# EAGLE design flute (EAGLE 6.1)
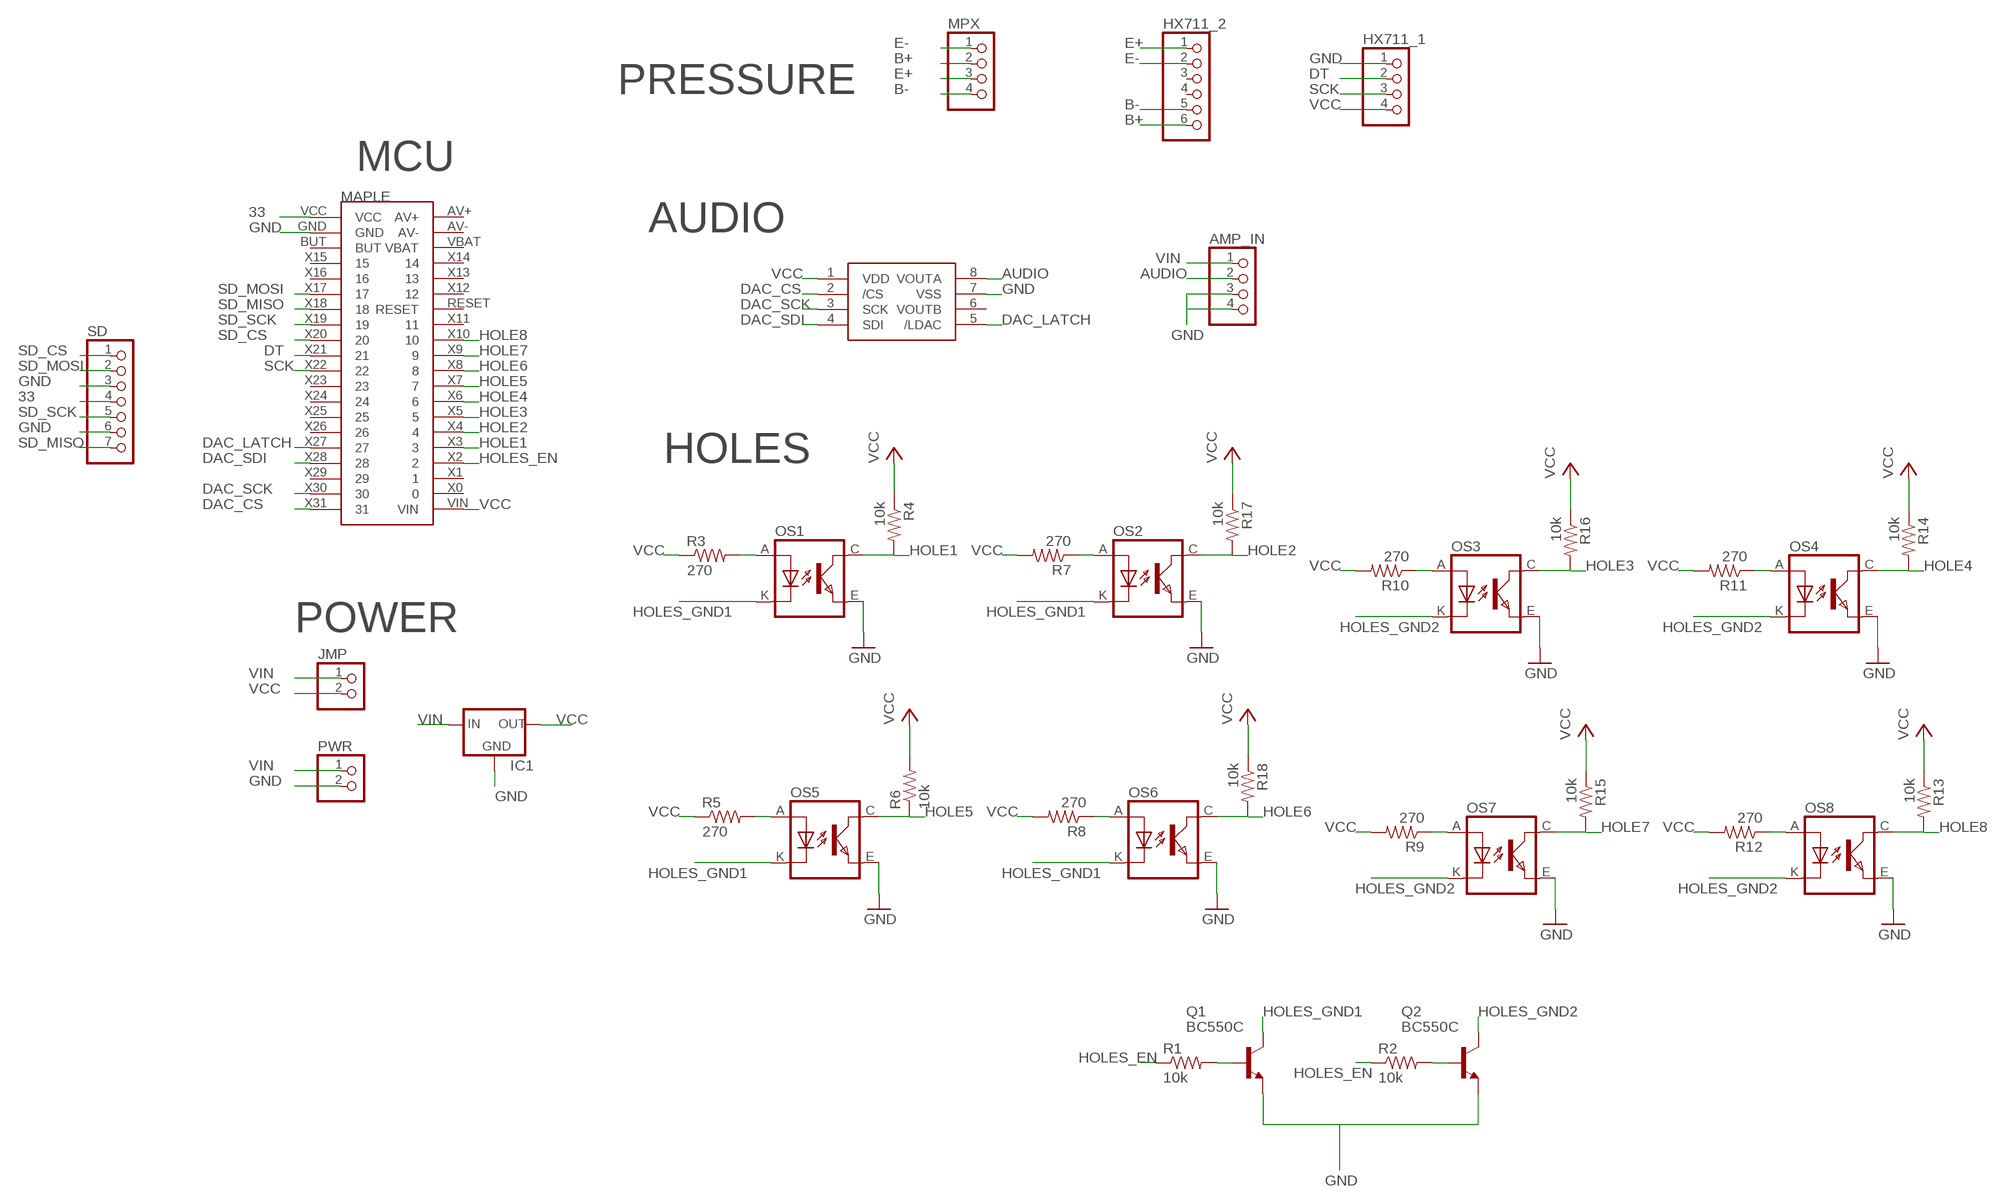
[diagram p0: schematic, sheet 1]

## Parts
AMP_IN  CONNEC_1X04  [CONNEC_1X04]
HX711_1  CONNEC_1X04  [CONNEC_1X04]
HX711_2  CONNEC_1X06  [CONNEC_1X06]
IC1  V_REG_78XX-TO-220  [TO-220-ALT]
JMP  CONNEC_1X02BASIC  [CONNEC_1X02]
MAPLE  MAPLE_MINI  [CONNEC_2X20]
MPX  CONNEC_1X04  [CONNEC_1X04]
OS1  TCRT5000  [TCRT5000]
OS2  TCRT5000  [TCRT5000]
OS3  TCRT5000  [TCRT5000]
OS4  TCRT5000  [TCRT5000]
OS5  TCRT5000  [TCRT5000]
OS6  TCRT5000  [TCRT5000]
OS7  TCRT5000  [TCRT5000]
OS8  TCRT5000  [TCRT5000]
PWR  CONNEC_1X02BASIC  [CONNEC_1X02]
Q1  BC550C  [TO92-EBC]
Q2  BC550C  [TO92-EBC]
R1  10k  RESISTOR0805-RES  [0805]
R2  10k  RESISTOR0805-RES  [0805]
R3  270  RESISTOR0805-RES  [0805]
R4  10k  RESISTOR0805-RES  [0805]
R5  270  RESISTOR0805-RES  [0805]
R6  10k  RESISTOR0805-RES  [0805]
R7  270  RESISTOR0805-RES  [0805]
R8  270  RESISTOR0805-RES  [0805]
R9  270  RESISTOR0805-RES  [0805]
R10  270  RESISTOR0805-RES  [0805]
R11  270  RESISTOR0805-RES  [0805]
R12  270  RESISTOR0805-RES  [0805]
R13  10k  RESISTOR0805-RES  [0805]
R14  10k  RESISTOR0805-RES  [0805]
R15  10k  RESISTOR0805-RES  [0805]
R16  10k  RESISTOR0805-RES  [0805]
R17  10k  RESISTOR0805-RES  [0805]
R18  10k  RESISTOR0805-RES  [0805]
SD  CONNEC_1X07  [CONNEC_1X07]
U$17  MCP4822  [SO08]

## Nets
33: MAPLE.VCC SD.4
AUDIO: AMP_IN.2 U$17.8(VOUTA)
B+: HX711_2.6 MPX.2
B-: HX711_2.5 MPX.4
DAC_CS: MAPLE.X31 U$17.2(/CS)
DAC_LATCH: MAPLE.X27 U$17.5(/LDAC)
DAC_SCK: MAPLE.X30 U$17.3(SCK)
DAC_SDI: MAPLE.X28 U$17.4(SDI)
DT: HX711_1.2 MAPLE.X21
E+: HX711_2.1 MPX.3
E-: HX711_2.2 MPX.1
GND [alim]: AMP_IN.3 AMP_IN.4 HX711_1.1 IC1.GND MAPLE.GND OS1.E(EMITTER) OS2.E(EMITTER) OS3.E(EMITTER) OS4.E(EMITTER) OS5.E(EMITTER) OS6.E(EMITTER) OS7.E(EMITTER) OS8.E(EMITTER) PWR.2 Q1.E Q2.E SD.3 SD.6 U$17.7(VSS)
HOLE1: MAPLE.X3 OS1.C(COLLECTOR) R4.2
HOLE2: MAPLE.X4 OS2.C(COLLECTOR) R17.2
HOLE3: MAPLE.X5 OS3.C(COLLECTOR) R16.2
HOLE4: MAPLE.X6 OS4.C(COLLECTOR) R14.2
HOLE5: MAPLE.X7 OS5.C(COLLECTOR) R6.1
HOLE6: MAPLE.X8 OS6.C(COLLECTOR) R18.2
HOLE7: MAPLE.X9 OS7.C(COLLECTOR) R15.2
HOLE8: MAPLE.X10 OS8.C(COLLECTOR) R13.2
HOLES_EN: MAPLE.X2 R1.1 R2.1
HOLES_GND1: OS1.K(CATHODE) OS2.K(CATHODE) OS5.K(CATHODE) OS6.K(CATHODE) Q1.C
HOLES_GND2: OS3.K(CATHODE) OS4.K(CATHODE) OS7.K(CATHODE) OS8.K(CATHODE) Q2.C
N$3: Q1.B R1.2
N$4: Q2.B R2.2
N$5: OS1.A(ANODE) R3.2
N$7: OS2.A(ANODE) R7.1
N$9: OS3.A(ANODE) R10.1
N$11: OS4.A(ANODE) R11.1
N$13: OS5.A(ANODE) R5.2
N$15: OS6.A(ANODE) R8.1
N$17: OS7.A(ANODE) R9.1
N$19: OS8.A(ANODE) R12.1
SCK: HX711_1.3 MAPLE.X22
SD_CS: MAPLE.X20 SD.1
SD_MISO: MAPLE.X18 SD.7
SD_MOSI: MAPLE.X17 SD.2
SD_SCK: MAPLE.X19 SD.5
VCC: HX711_1.4 IC1.OUT JMP.2 MAPLE.VIN R3.1 R4.1 R5.1 R6.2 R7.2 R8.2 R9.2 R10.2 R11.2 R12.2 R13.1 R14.1 R15.1 R16.1 R17.1 R18.1 U$17.1(VDD)
VIN [alim]: AMP_IN.1 IC1.IN JMP.1 PWR.1
Unconnected: HX711_2.3 HX711_2.4 MAPLE.AV+ MAPLE.AV- MAPLE.BUT MAPLE.RESET MAPLE.VBAT MAPLE.X0 MAPLE.X1 MAPLE.X11 MAPLE.X12 MAPLE.X13 MAPLE.X14 MAPLE.X15 MAPLE.X16 MAPLE.X23 MAPLE.X24 MAPLE.X25 MAPLE.X26 MAPLE.X29 U$17.6(VOUTB)

## Notes on the sheet
- PRESSURE
- MCU
- AUDIO
- HOLES
- POWER

## Library data of the parts
AMP_IN HX711_1 MPX = rhoban:CONNEC_1X04
HX711_2 = rhoban:CONNEC_1X06
IC1 = SparkFun-PowerIC:V_REG_78XX: Voltage Regulator Standard 7805 5V regulator. IGO (Input Ground Output). Spark Fun Electronics SKU : COM-00107
JMP PWR = rhoban:CONNEC_1X02
MAPLE = rhoban:MAPLE_MINI
OS1-OS8 = tcrt5000:TCRT5000
Q1 Q2 = transistor-npn:BC550*: NPN Transistor
R1-R18 = SparkFun-Passives:RESISTOR: Resistor Basic schematic elements and footprints for 0603, 1206, and PTH resistors.
SD = rhoban:CONNEC_1X07
U$17 = rhoban:MCP4822

## Net classes
0 default: width 0.305 mm
1 alim: width 0.762 mm, clearance 0.076 mm

## Board
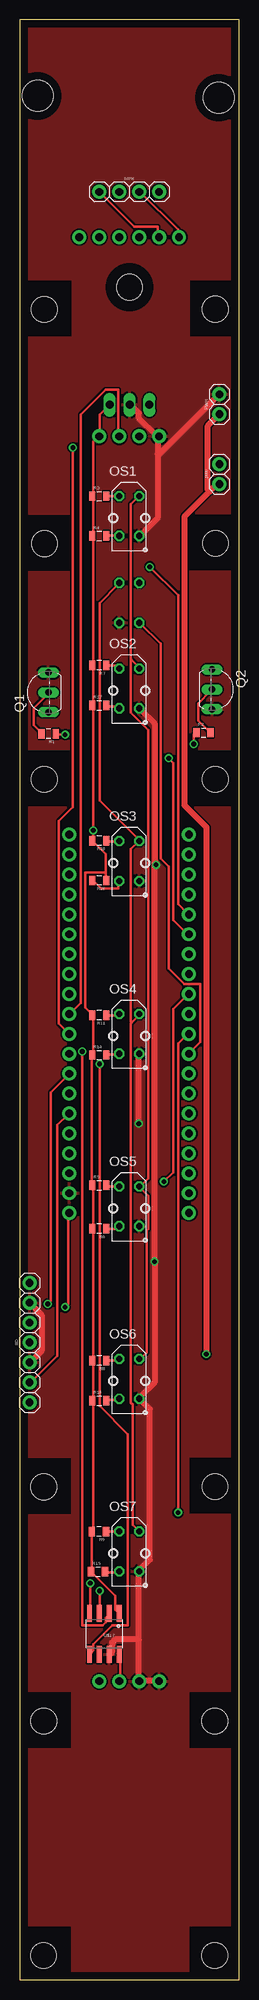
[diagram p1: board, top side]
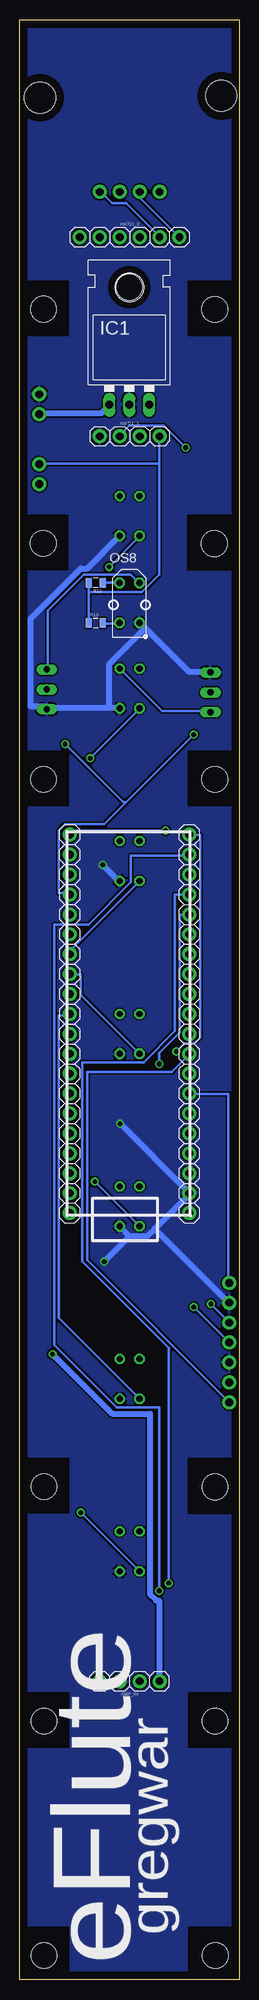
[diagram p2: board, bottom side, seen from below]

Size 28 x 250 mm. Coordinates in mm from the lower left corner, seen from the top.
Outline: 0,0 28,0 28,250 0,250 0,0
Copper layers (1*16): Top 0.035mm / dielectric 1.5mm / Bottom 0.035mm
Design rules: minimum track width 10mil, minimum drill 24mil, track to track 8mil, track to pad 8mil, pad to pad 8mil, via to via 8mil, smd to smd 8mil, copper to edge 40mil, drill to drill 8mil, minimum pad ring 10mil, minimum via ring 8mil, stop-mask expansion 4mil, vias tented up to drill 0mil, thermal gap 10mil
Holes 4 mm at 2.29,240.28 25.4,240.03
tRestrict: area -0.1,-0.3 to 6.5,6.8; area 21.7,-0.3 to 28.3,6.8; area -0.1,29.6 to 6.5,36.7; area 21.7,29.6 to 28.3,36.7; area -0.1,59.5 to 6.5,66.5; area 21.7,59.5 to 28.4,66.6; area -0.1,149.7 to 6.6,156.8; area 21.8,149.7 to 28.4,156.8; area 0,179.8 to 6.6,186.8; area 21.8,179.8 to 28.5,186.9; area -0.1,209.6 to 6.6,216.7; area 21.8,209.6 to 28.4,216.7
bRestrict: area -0.1,-0.3 to 6.5,6.8; area 21.7,-0.3 to 28.3,6.8; area -0.1,29.6 to 6.5,36.7; area 21.7,29.6 to 28.3,36.7; area -0.1,59.5 to 6.5,66.5; area 21.7,59.5 to 28.4,66.6; area -0.1,149.7 to 6.6,156.8; area 21.7,149.7 to 28.4,156.8; area 0,179.7 to 6.6,186.8; area 21.8,179.8 to 28.4,186.9; area -0.1,209.6 to 6.6,216.7; area 21.7,209.6 to 28.4,216.7

### Footprints (pad centres in the part's own frame; a part is rotated, then mirrored left to right if it is on the bottom)
CONNEC_1X04 = drill 1 pad 1.778: 1 -1.27,1.27; 2 1.27,1.27; 3 3.81,1.27; 4 6.35,1.27
CONNEC_1X06 = drill 1 pad 1.778: 1 -1.27,1.27; 2 1.27,1.27; 3 3.81,1.27; 4 6.35,1.27; 5 8.89,1.27; 6 11.43,1.27
TO-220-ALT = drill 1.016 long: GND 0,-3.81; IN -2.54,-3.81; OUT 2.54,-3.81 | hole 3.302: 0,11.176
CONNEC_1X02 = drill 1 pad 1.778: 1 -1.27,1.27; 2 1.27,1.27
CONNEC_2X20 = drill 1 pad 1.778: AV+ 0,0; AV- 2.54,0; BUT 5.08,-15.24; GND 2.54,-15.24; RESET 15.24,0; VBAT 5.08,0; VCC 0,-15.24; VIN 48.26,0; X0 45.72,0; X1 43.18,0; X2 40.64,0; X3 38.1,0; X4 35.56,0; X5 33.02,0; X6 30.48,0; X7 27.94,0; X8 25.4,0; X9 22.86,0; X10 20.32,0; X11 17.78,0; X12 12.7,0; X13 10.16,0; X14 7.62,0; X15 7.62,-15.24; X16 10.16,-15.24; X17 12.7,-15.24; X18 15.24,-15.24; X19 17.78,-15.24; X20 20.32,-15.24; X21 22.86,-15.24; X22 25.4,-15.24; X23 27.94,-15.24; X24 30.48,-15.24; X25 33.02,-15.24; X26 35.56,-15.24; X27 38.1,-15.24; X28 40.64,-15.24; X29 43.18,-15.24; X30 45.72,-15.24; X31 48.26,-15.24
TCRT5000 = drill 0.8 octagon: A -2.54,-1.27; C 2.54,-1.27; E 2.54,1.27; K -2.54,1.27
TO92-EBC = drill 0.813 long: B 0,-1.27; C -2.54,-1.27; E 2.54,-1.27
0805 = smd 0.8 x 1.2: 1 -0.9,0; 2 0.9,0
CONNEC_1X07 = drill 1 pad 1.778: 1 -1.27,1.27; 2 1.27,1.27; 3 3.81,1.27; 4 6.35,1.27; 5 8.89,1.27; 6 11.43,1.27; 7 13.97,1.27
STAND-OFF = hole 3.302: 0,0
SO08 = smd 0.61 x 2.21: 1 -1.905,-2.616; 2 -0.635,-2.616; 3 0.635,-2.616; 4 1.905,-2.616; 5 1.905,2.616; 6 0.635,2.616; 7 -0.635,2.616; 8 -1.905,2.616

### Placement (x,y rotation side)
AMP_IN  11.43,39.37 180 bottom
HX711_1  16.51,195.58 0 bottom
HX711_2  19.05,220.98 0 bottom
IC1  14.01,204.69 0 bottom
JMP  26.75,192.05 90 top
MAPLE  21.59,97.79 90 bottom
MPX  11.43,226.76 0 top
OS1  13.97,186.69 270 top
OS2  13.97,164.69 270 top
OS3  13.97,142.69 270 top
OS4  13.97,120.65 270 top
OS5  13.97,98.65 270 top
OS6  13.97,76.65 270 top
OS7  13.97,54.65 270 top
OS8  13.99,175.62 270 bottom
PWR  26.75,200.94 90 top
Q1  2.41,164.2 90 top
Q2  25.81,164.58 270 top
R1  3.7,158.92 180 top
R2  23.45,159.07 0 top
R3  10.16,189.23 0 top
R4  10.16,184.15 0 top
R5  10.16,101.36 0 top
R6  10.16,95.78 180 top
R7  10.16,167.64 180 top
R8  10.16,78.96 180 top
R9  10.11,57.17 180 top
R10  10.16,145.28 180 top
R11  10.16,123.03 180 top
R12  18.3,178.14 180 bottom
R13  18.3,173.06 0 bottom
R14  10.16,117.95 0 top
R15  9.99,52.08 0 top
R16  10.16,140.2 180 top
R17  10.16,162.56 0 top
R18  10.16,73.88 0 top
SD  2.54,74.93 90 top
U$1  [STAND-OFF]  3.06,3.1 0 top
U$2  [STAND-OFF]  24.87,3.12 0 top
U$3  [STAND-OFF]  3.07,33 0 top
U$4  [STAND-OFF]  24.88,33.02 0 top
U$5  [STAND-OFF]  3.08,62.88 0 top
U$6  [STAND-OFF]  24.89,62.9 0 top
U$7  [STAND-OFF]  3.13,153.11 0 top
U$8  [STAND-OFF]  24.94,153.13 0 top
U$9  [STAND-OFF]  3.18,183.18 0 top
U$10  [STAND-OFF]  24.99,183.19 0 top
U$11  [STAND-OFF]  3.13,213.05 0 top
U$12  [STAND-OFF]  24.94,213.07 0 top
U$17  10.8,44.13 180 top

### Tracks (layer width: path | path; a pad name or v marks a point on that pad's centre or on a via)
33  (via drill 0.61)
  Top 0.305: v5.8,85.8 6.2,86.2 6.2,97.6 MAPLE.VCC
  Bottom 0.305: v5.8,85.8 1.4,81.4 SD.4
AUDIO
  Top 0.305: U$17.8 12.8,41.4 12.8,38.2 AMP_IN.2
B+
  Bottom 0.305: HX711_2.6 7.8,222.4 12.6,227.2 12.6,228 MPX.2
B-
  Bottom 0.305: HX711_2.5 10.2,222.4 14.4,226.6 16.2,226.6 17.6,228 MPX.4
DAC_CS  (via drill 0.61)
  Top 0.305: v8,118.4 8,45.2 10.6,45.2 11,45.6 11,46.2 11.4,46.6 U$17.2
  Bottom 0.305: v8,118.4 7,119.4 5.8,119.4 5,120.2 5,146 6.2,146 MAPLE.X31
DAC_LATCH  (via drill 0.61)
  Top 0.305: v10.2,116.8 10.2,73.2 13.8,69.6 13.8,45.2 11.8,45.2 9.4,42.8 9.4,42 9,41.6 U$17.5
  Bottom 0.305: v10.2,116.8 10.2,118.2 7.6,120.8 7.6,135.8 6.4,135.8 MAPLE.X27
DAC_SCK  (via drill 0.61)
  Top 0.305: v10.2,49.6 10.2,46.8 U$17.3
  Bottom 0.305: v10.2,49.6 10.2,73 15.6,73 23.6,81 23.6,134.6 19.2,134.6 13.8,140 13.8,143.4 6.4,143.4 MAPLE.X30
DAC_SDI  (via drill 0.61)
  Top 0.305: v9,50.6 9,46.8 U$17.4
  Bottom 0.305: v9,50.6 9,80.6 20,91.6 20,117 12.2,117 8.2,121 8.2,138.4 6.4,138.4 MAPLE.X28
DT  (via drill 0.61)
  Top 0.305: MAPLE.X21 5,122 5,147.8 6.8,149.6 v6.8,195.4
  Bottom 0.305: v6.8,195.4 9.6,198.2 14,198.2 15.2,197 HX711_1.2
E+
  Top 0.305: MPX.3 15.4,228 20.2,223.2 20.2,222.4 HX711_2.1
E-
  Top 0.305: MPX.1 10.2,228 14.6,223.6 17.6,223.6 17.6,222.4 HX711_2.2
GND  (via drill 0.61)
  Top 0.762: 17.6,194.6 17.6,196.8 HX711_1.1 17.4,197 15.2,199.2 15.2,199.8 14.2,200.8 IC1.GND | 17.6,194.6 17.6,186.4 15.4,184.2 OS1.E | PWR.2 25.4,202.2 17.8,194.6 17.6,194.6 | OS2.E 15.4,162 17.2,160.2 17.2,142.4 v17.4,142.2 17.2,142 v17.2,91.6 17.2,76.2 15.4,74.4 OS6.E 15.4,74 16.6,72.8 16.6,53.6 15.4,52.4 OS7.E 15.2,52 15.2,43.4 | 15.2,43.4 12.2,43.4 11.8,43 11.8,41.8 11.6,41.6 U$17.7 | 15.2,43.4 15.2,38.2 AMP_IN.3 15.6,38.2 17.6,38.2 AMP_IN.4 | SD.3 1.4,78.8 2.8,80.2 2.8,84.8 1.4,86.2 SD.6 | v15.2,109.2 15.2,118 OS4.E
  Bottom 0.762: 12,172.4 6.4,166.8 3.8,166.8 Q1.E | 12,172.4 12.6,173 OS8.E | v17.4,142.2 15.4,140.2 OS3.E | 16.6,162.2 15.4,162.2 OS2.E | 16.6,162.2 24.4,162.2 Q2.E 24.6,162.4 26.6,162.4 26.6,173.6 20.2,180 19.4,180 15.4,184 OS1.E | 12,172.4 16.6,167.8 16.6,162.2 | 14,94.8 15.2,96 OS5.E | 14,94.8 11.8,94.8 10.8,95.8 | 10.8,95.8 6.4,100.2 MAPLE.GND 6.6,100.6 v15.2,109.2 | 10.8,95.8 1.4,86.4 SD.6 | 14,94.8 v17.2,91.6
  pour Top: -58.47,259.18 84.39,259.18 84.39,-14.37 -67.29,-14.37 -67.29,176.84
  pour Bottom: -9.93,265.81 43.58,265.81 43.58,-8.29 -30.34,-8.29 -30.34,233.21
HOLE1  (via drill 0.61)
  Top 0.305: R4.2 11.2,184.2 12.6,184.2 OS1.C | v16.6,180.2 20.2,176.6 20.2,137.2 21.4,136 MAPLE.X3
  Bottom 0.305: v16.6,180.2 12.8,184 OS1.C
HOLE2  (via drill 0.61)
  Top 0.305: R17.2 11.2,162.4 12.6,162.4 12.6,162.2 OS2.C | v19,155.8 19.6,155.2 19.6,135.2 21.4,133.4 MAPLE.X4
  Bottom 0.305: v19,155.8 12.8,162 OS2.C
HOLE3
  Top 0.305: R16.2 9.4,140.2 10.4,139.2 12.6,139.2 12.6,140 OS3.C
  Bottom 0.305: OS3.C 12.8,140 21.4,131.4 21.4,131 MAPLE.X5
HOLE4
  Top 0.305: R14.2 11.2,118 12.6,118 OS4.C
  Bottom 0.305: OS4.C 12.8,118.2 20.2,125.6 20.2,128.2 21.4,128.2 MAPLE.X6
HOLE5  (via drill 0.61)
  Top 0.305: R6.1 11.2,95.8 12.6,95.8 12.6,96 OS5.C | v18.4,101.8 19.6,103 19.6,123.8 21.4,125.6 MAPLE.X7
  Bottom 0.305: v18.4,101.8 12.8,96.2 OS5.C
HOLE6
  Top 0.305: R18.2 11.2,74 12.6,74 OS6.C
  Bottom 0.305: OS6.C 12.8,74.2 23,84.4 23,123 21.6,123 MAPLE.X8
HOLE7  (via drill 0.61)
  Top 0.305: R15.2 11,52 12.6,52 OS7.C | v20.2,59.6 20.2,119.4 21.4,120.6 MAPLE.X9
  Bottom 0.305: v20.2,59.6 12.8,52.2 OS7.C
HOLE8
  Top 0.305: OS8.C 15.4,173 18,170.4 18,143 19,142 19,129 21,127 23,127 23,119.6 21.6,118.2 MAPLE.X10
  Bottom 0.305: R13.2 17.2,173 15.4,173 OS8.C
HOLES_EN  (via drill 0.61)
  Top 0.305: v5.8,158.8 4.8,158.8 R1.1 | v22.2,157.6 22.2,158.8 22.4,159 R2.1
  Bottom 0.305: 14.5,150.1 17.2,147.4 22.2,147.4 23,146.6 23,138.6 21.6,138.6 MAPLE.X2 | 14.5,150.1 v5.8,158.8 | v22.2,157.6 14.8,150.2 14.6,150.2 14.5,150.1
HOLES_GND1
  Top 0.305: OS6.K 15.4,79.2 16.2,80 16.2,95.6 16.4,95.8 16.4,100 15.4,101 OS5.K 15.4,101.2 16.4,102.2 16.4,159.4 14.2,161.6 14.2,168.2 14.3,168.3 | 14.3,168.3 15.2,167.4 OS2.K | 14.3,168.3 14.2,168.4 14.2,188.2 15.2,189.2 OS1.K
  Bottom 0.305: OS2.K 15.2,167.2 9.8,161.8 3.8,161.8 Q1.C
HOLES_GND2
  Top 0.305: 14.3,122.1 15.2,123 OS4.K | 14.3,122.1 14.2,122 14.2,73.6 14.4,73.4 14.4,58 15.2,57.2 OS7.K | 14.3,122.1 14.2,122.2 14.2,144.2 15.2,145.2 OS3.K 15.2,145.4 10.2,150.4 10.2,175.6 12.6,178 OS8.K
  Bottom 0.305: OS8.K 12.8,178.2 13.8,179.2 19.8,179.2 24.4,174.6 24.4,167.2 Q2.C
N$3
  Top 0.305: R1.2 2.8,159 1.8,160 1.8,162.2 3.6,164 Q1.B
N$4
  Top 0.305: R2.2 24.2,159.2 22.8,160.6 22.8,162.8 24.4,164.4 Q2.B
N$5
  Top 0.305: R3.2 11.2,189.2 12.6,189.2 OS1.A
N$7
  Top 0.305: R7.1 11.2,167.6 12.6,167.6 12.6,167.4 OS2.A
N$9
  Top 0.305: R10.1 11.2,145.2 12.6,145.2 OS3.A
N$11
  Top 0.305: R11.1 11.2,123 12.6,123 OS4.A
N$13
  Top 0.305: R5.2 11.2,101.2 12.6,101.2 OS5.A
N$15
  Top 0.305: R8.1 11.2,79 12.6,79 OS6.A
N$17
  Top 0.305: R9.1 11.2,57.2 12.6,57.2 OS7.A
N$19
  Bottom 0.305: R12.1 17.2,178.2 15.4,178.2 OS8.A
SCK
  Top 0.305: MAPLE.X22 6.4,123.2 7.8,124.6 7.8,199.6 11,202.8 12.6,202.8 12.6,197 HX711_1.3
SD_CS
  Bottom 0.305: SD.1 1.4,73.8 19.4,91.8 19.4,115.8 8.6,115.8 6.4,118 MAPLE.X20
SD_MISO
  Bottom 0.305: SD.7 1.4,89 1.4,113 6.2,113 MAPLE.X18
SD_MOSI
  Top 0.305: SD.2 1.4,76.2 4.8,79.6 4.8,109 6.2,110.4 MAPLE.X17
SD_SCK  (via drill 0.61)
  Top 0.305: v3.6,86.2 4,86.6 4,113.2 6.2,115.4 MAPLE.X19
  Bottom 0.305: v3.6,86.2 1.4,84 SD.5
VCC  (via drill 0.61)
  Top 0.305: IC1.OUT 11.4,200.8 10.2,199.6 10.2,197 HX711_1.4 10,196.8 9.4,196.2 9.4,189.4 R3.1 9.4,189.2 9.4,184.2 R4.1 9.4,184 9.4,167.8 R7.2 9.4,167.6 9.4,162.6 R17.1 9.4,162.4 v9.4,146.6 9.4,145.4 R10.2 9.4,145.2 11,143.6 11,141.2 | 11,141.2 11,140.2 R16.1 | U$17.1 12.6,46.8 12.2,47.2 12.2,49 9.2,52 R15.1 9.2,52.2 9.2,57 R9.2 9.4,57.2 9.4,73.8 R18.1 9.4,74 9.4,78.8 R8.2 9.4,79 9.4,95.6 R6.2 9.4,95.8 9.4,101.2 R5.1 9.2,101.4 9.2,117.8 R14.1 9.4,118 9.4,123 R11.2 9.2,123.2 8.4,124 8.4,141.2 11,141.2
  Bottom 0.305: 19.2,177 19.2,178 R12.2 | 19.2,177 19.2,173.2 R13.1 | 19.2,177 12.4,177 10.2,179.2 10.2,193.4 | 10.2,193.4 10.2,196.8 HX711_1.4 | 10.2,193.4 25.4,193.4 JMP.2 | v9.4,146.6 21,146.6 21.4,146.2 MAPLE.VIN
VIN  (via drill 0.61)
  Top 0.762: v23.8,79.8 23.8,147 21,149.8 21,186.6 24.2,189.8 | 24.2,189.8 25,190.6 25.4,190.6 JMP.1 | PWR.1 25.4,199.6 24,198.2 24,190 24.2,189.8
  Bottom 0.762: IC1.IN 16.6,200.8 17.6,199.8 25.4,199.8 PWR.1 | v23.8,79.8 16.2,72.2 11.4,72.2 11.4,49.2 10.6,48.4 10.2,48.4 10.2,38.2 AMP_IN.1

### Text on the board
_bsilk: gregwar | eFlute